# EAGLE design relay_load (EAGLE 9.5.2)
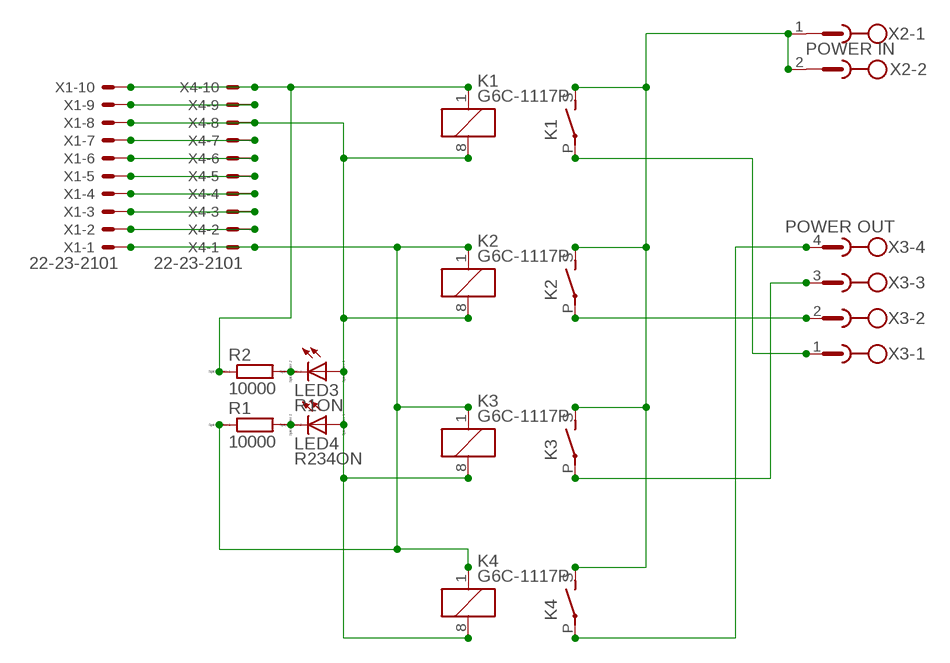
[diagram p0: schematic, sheet 1]

## Parts
K1  G6C-1117P  [G6C-1117P]
K2  G6C-1117P  [G6C-1117P]
K3  G6C-1117P  [G6C-1117P]
K4  G6C-1117P  [G6C-1117P]
LED3  R1ON  LED_E  [LED_1206]
LED4  R234ON  LED_E  [LED_1206]
R1  10000  RR1206  [R1206]
R2  10000  RR1206  [R1206]
X1  22-23-2101  [22-23-2101]
X2  POWER IN  MSTBV2  [MSTBV2]
X3  POWER OUT  MSTBV4  [MSTBV4]
X4  22-23-2101  [22-23-2101]

## Nets
N$1 [i-current]: K1.S(2:S) K2.S(2:S) K3.S(2:S) K4.S(2:S) X2.1 X2.2
N$2: K1.8 K2.8 K3.8 K4.8 LED3.A LED4.A X1.8 X4.8
N$3: K1.1 R2.1 X1.10 X4.10
N$4: K2.1 K3.1 K4.1 R1.1 X1.1 X4.1
N$5: X1.9 X4.9
N$6: X1.7 X4.7
N$7 [i-current]: K1.P(2:P) X3.1
N$8 [i-current]: K2.P(2:P) X3.2
N$9 [i-current]: K3.P(2:P) X3.3
N$10 [i-current]: K4.P(2:P) X3.4
N$11: X1.6 X4.6
N$12: X1.5 X4.5
N$13: X1.4 X4.4
N$14: X1.3 X4.3
N$15: X1.2 X4.2
N$16: LED4.C R1.2
N$17: LED3.C R2.2

## Library data of the parts
K1-K4 = relay:G6C-1117P: RELAY 1 x norm. open, 10 A/240 V, Omron; OC_FARNELL: unknown; OC_NEWARK: unknown
LED3 LED4 = eagle-ltspice:LED_E: LED Source: http://www.osram.convergy.de Source: www.luxeon.com Source: www.kingbright.com; SPICEMODEL: NONE; SPICEPREFIX: D; SPICETYPE: diode
R1 R2 = eagle-ltspice:R: RESISTOR, European symbol; SPICEMODEL: NONE; SPICEPREFIX: R
X1 X4 = con-molex:22-23-2101: .100" (2.54mm) Center Header - 10 Pin; MF: MOLEX; MPN: 22-23-2101; OC_FARNELL: 1756828; OC_NEWARK: 94C0765
X2 = con-phoenix-500:MSTBV2: PHOENIX; OC_FARNELL: unknown; OC_NEWARK: unknown
X3 = con-phoenix-508:MSTBV4: PHOENIX; MPN: MSTBV 2,5/4-GF-5.08; OC_FARNELL: 1792794; OC_NEWARK: 69R9847

## Net classes
1 i-current: width 3.6 mm

## Board
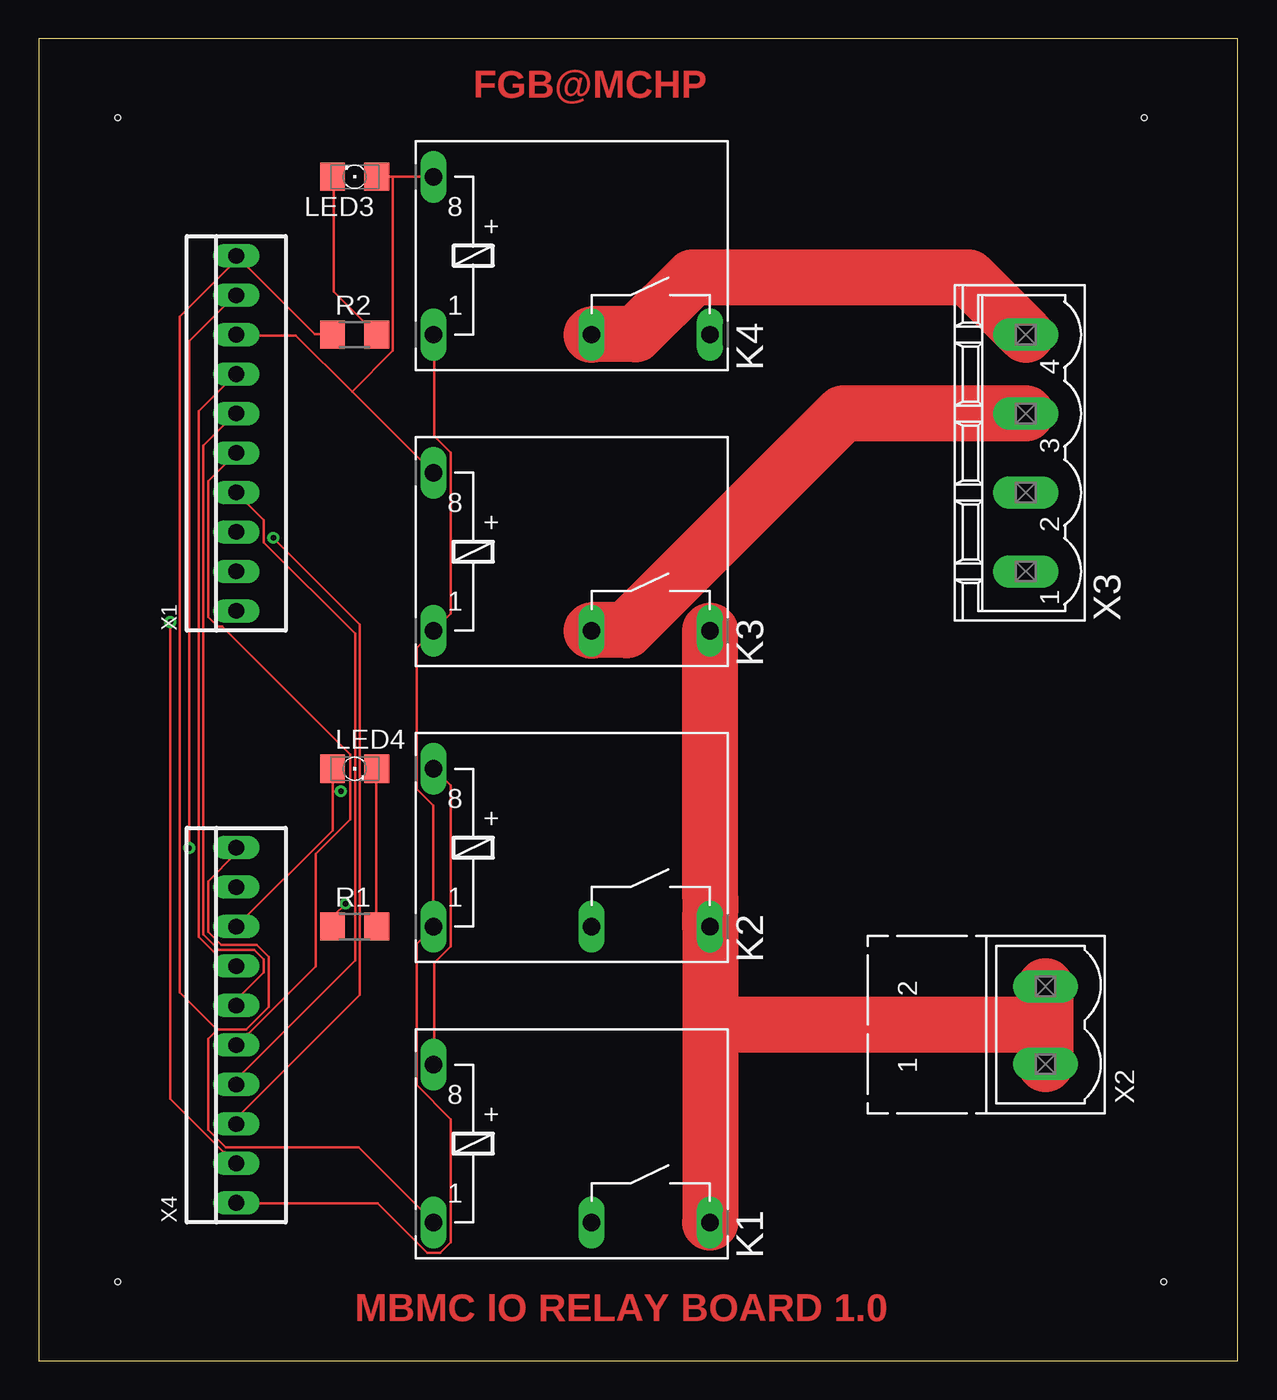
[diagram p1: board, top side]
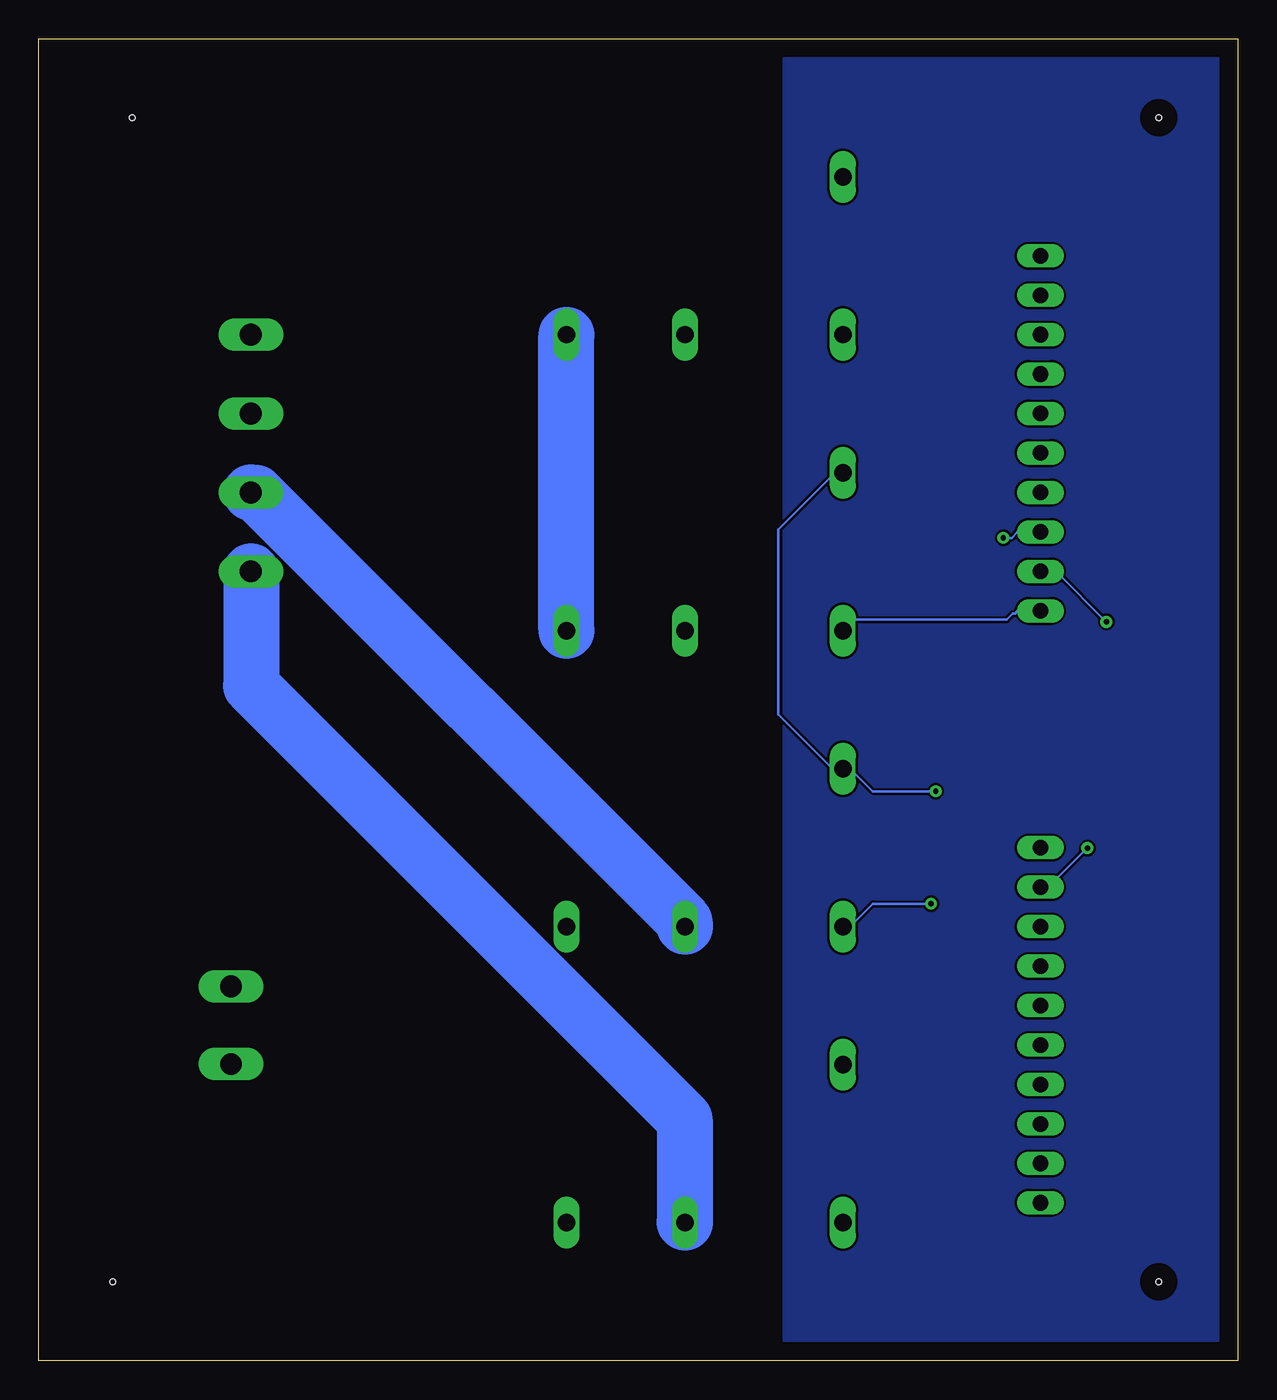
[diagram p2: board, bottom side, seen from below]

Size 77.14 x 85.08 mm. Coordinates in mm from the lower left corner, seen from the top.
Outline: 0,0 77.14,0 77.14,85.08 0,85.08 0,0
Copper layers (1*16): Top 0.035mm / dielectric 1.5mm / Bottom 0.035mm
Design rules "default": minimum track width 6mil, minimum drill 0.35mm, track to track 6mil, track to pad 6mil, pad to pad 6mil, via to via 6mil, smd to smd 6mil, copper to edge 40mil, drill to drill 6mil, minimum pad ring 10mil, minimum via ring 8mil, stop-mask expansion 4mil, vias tented up to drill 0mil, thermal gap 10mil
Holes 0.35 mm at 5.08,80.01 71.12,80.01 72.39,5.08 5.08,5.08

### Footprints (pad centres in the part's own frame; a part is rotated, then mirrored left to right if it is on the bottom)
G6C-1117P = drill 1.118 long: 1 -8.89,-5.08; 8 -8.89,5.08; P 1.27,-5.08; S 8.89,-5.08
LED_1206 = smd 1.6 x 1.803: A -1.422,0; C 1.422,0
R1206 = smd 1.6 x 1.803: 1 -1.422,0; 2 1.422,0
22-23-2101 = drill 1 long: 1 -11.43,0; 2 -8.89,0; 3 -6.35,0; 4 -3.81,0; 5 -1.27,0; 6 1.27,0; 7 3.81,0; 8 6.35,0; 9 8.89,0; 10 11.43,0
MSTBV2 = drill 1.397 long: 1 -2.5,0; 2 2.5,0
MSTBV4 = drill 1.397 long: 1 -7.62,0; 2 -2.54,0; 3 2.54,0; 4 7.62,0

### Placement (x,y rotation side)
K1  34.29,13.97 0 top
K2  34.29,33.02 0 top
K3  34.29,52.07 0 top
K4  34.29,71.12 0 top
LED3  20.32,76.2 180 top
LED4  20.32,38.1 0 top
R1  20.32,27.94 0 top
R2  20.32,66.04 0 top
X1  12.7,59.69 90 top
X2  64.77,21.59 90 top
X3  63.5,58.42 90 top
X4  12.7,21.59 90 top

### Tracks (layer width: path | path; a pad name or v marks a point on that pad's centre or on a via)
GND
  pour Bottom: 1.27,83.82 29.21,83.82 29.21,1.27 1.27,1.27
N$1
  Top 3.6: X2.2 64.77,21.64 | 64.77,21.64 X2.1 | 43.2,21.64 43.2,27.89 K2.S 43.2,29.72 43.2,46.94 K3.S | 43.2,21.64 43.2,8.91 K1.S | 43.2,21.64 64.77,21.64
  Bottom 3.6: K4.S 43.2,65.99 43.2,47.02 K3.S
N$2  (via drill 0.35)
  Top 0.152: 18.9,36.65 18.9,34.14 X4.8 | 18.9,36.65 LED4.A | LED4.A | K1.8 25.45,19.05 25.45,25.6 26.52,26.67 26.52,37.03 25.45,38.1 K2.8 | v19.43,36.65 18.9,36.65 | K4.8 22.78,76.2 | 22.78,76.2 LED3.A | 20.16,62.37 25.38,57.15 K3.8 | 20.16,62.37 16.54,65.99 12.73,65.99 X1.8 | 22.78,76.2 22.78,65 20.16,62.37
  Bottom 0.152: v19.43,36.65 23.47,36.65 24.92,38.1 K2.8 26.06,38.1 29.57,41.6 29.57,53.49 25.91,57.15 K3.8
N$3
  Top 0.152: R2.1 18.9,66.06 17.76,66.06 X1.10 12.8,70.94 9.07,67.21 9.07,23.7 11.47,21.3 | 11.47,21.3 10.9,20.73 10.9,14.86 12.04,13.72 20.57,13.72 K1.1 | 11.47,21.3 11.51,21.34 13.34,21.34 14.78,22.78 14.78,25.98 14.02,26.75 11.73,26.75 10.9,27.58 10.9,30.86 12.65,32.61 12.65,32.99 X4.10
N$4  (via drill 0.35)
  Top 0.152: v19.74,29.41 18.97,28.65 18.97,27.96 R1.1 | X4.1 12.73,10.13 21.79,10.13 24.99,6.93 25.83,6.93 26.52,7.62 26.52,15.54 24.31,17.75 24.31,26.82 25.38,27.89 K2.1 25.38,27.96 25.38,35.74 24.31,36.8 24.31,45.87 25.38,46.94 K3.1 25.45,47.02 26.52,48.08 26.52,58.45 25.45,59.51 25.45,65.99 K4.1
  Bottom 0.152: v19.74,29.41 23.47,29.41 24.92,27.96 25.38,27.96 K2.1 | K3.1 24.69,47.7 14.86,47.7 14.48,48.08 14.33,48.08 14.17,48.23 12.73,48.23 X1.1
N$5  (via drill 0.35)
  Top 0.152: v9.68,32.99 9.68,65.61 12.65,68.58 X1.9
  Bottom 0.152: X4.9 12.19,30.48 v9.68,32.99
N$6
  Top 0.152: X4.7 12.65,25.45 12.12,25.45 10.29,27.28 10.29,61.11 12.65,63.48 X1.7
N$7
  Bottom 3.6: K1.P 35.59,8.91 35.59,15.54 63.47,43.43 63.47,50.75 X3.1
N$8
  Bottom 3.6: K2.P 35.59,27.96 35.59,28.27 63.17,55.85 63.47,55.85 X3.2
N$9
  Top 3.6: X3.3 51.74,60.96 37.8,47.02 35.59,47.02 K3.P
N$10
  Top 3.6: X3.4 59.82,69.72 42.06,69.72 38.41,66.06 35.59,66.06 K4.P
N$11
  Top 0.152: X4.6 12.73,22.86 12.73,23.24 14.48,24.99 14.48,25.83 13.87,26.44 11.58,26.44 10.59,27.43 10.59,58.9 12.65,60.96 X1.6
N$12
  Top 0.152: X4.5 13.41,21.03 13.49,21.03 17.83,25.38 17.83,32.61 20.04,34.82 20.04,39.01 11.81,47.24 11.51,47.24 10.9,47.85 10.9,56.62 X1.5
N$13
  Top 0.152: X1.4 14.48,54.1 14.48,52.65 20.34,46.79 20.34,25.76 12.73,18.14 12.73,17.83 X4.4
N$14  (via drill 0.35)
  Top 0.152: v15.09,52.96 20.65,47.4 20.65,23.55 12.73,15.62 12.73,15.24 X4.3
  Bottom 0.152: v15.09,52.96 14.55,52.96 14.17,53.34 X1.3
N$15  (via drill 0.35)
  Top 0.152: v8.46,47.55 8.46,16.84 11.89,13.41 11.96,13.41 12.65,12.72 X4.2
  Bottom 0.152: v8.46,47.55 11.66,50.75 12.65,50.75 X1.2
N$16
  Top 0.152: R1.2 21.72,27.96 21.72,38.1 LED4.C
N$17
  Top 0.152: LED3.C 18.97,76.2 18.97,68.81 21.72,66.06 R2.2

### Text on the board
Top: FGB@MCHP | MBMC IO RELAY BOARD 1.0